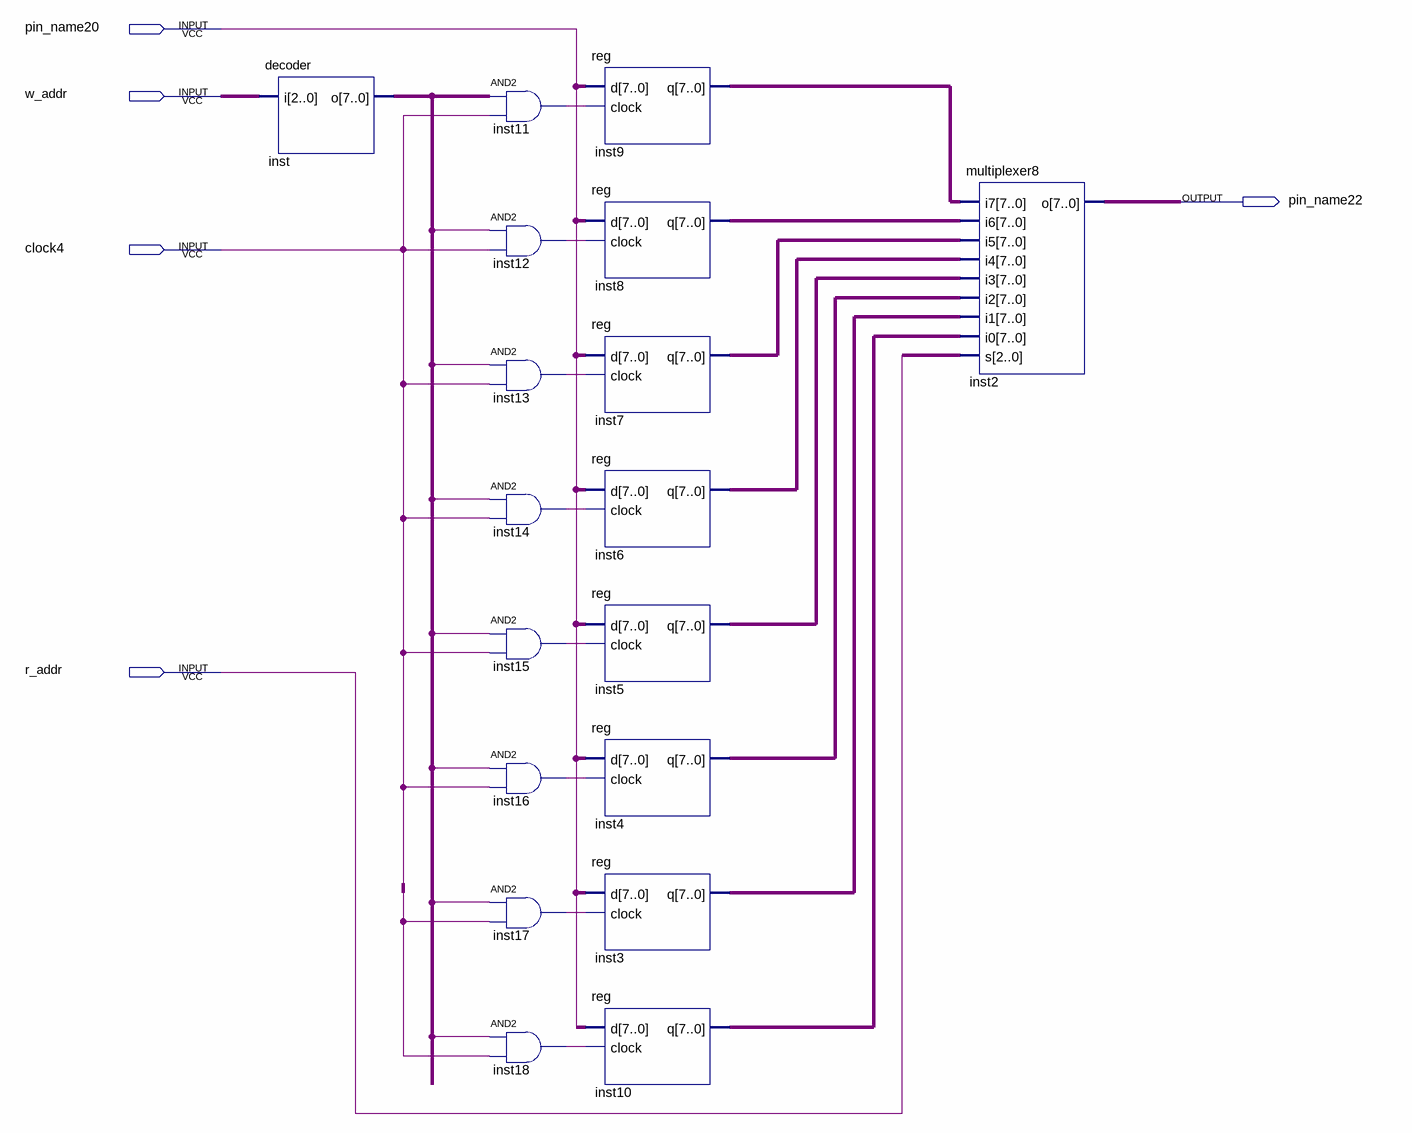
[diagram p0: schematic sheet]
// Quartus schematic registerfile.bdf as structural Verilog: 18 symbols, 5 pins
module registerfile (
  input  pin_name20,
  input  w_addr,
  input  clock4,
  input  r_addr,
  output pin_name22
);

  wire inst11_out, inst12_out, inst13_out, inst14_out, inst15_out, inst16_out, inst17_out, inst18_out,
       undriven, undriven_2, undriven_3, undriven_4, undriven_5, undriven_6, undriven_7, undriven_8;
  wire [2:0] undriven_9, undriven_10;
  wire [7:0] inst2_o, inst3_q, inst4_q, inst5_q, inst6_q, inst7_q, inst8_q, inst9_q, inst10_q, inst_o,
       undriven_11, undriven_12, undriven_13, undriven_14, undriven_15, undriven_16, undriven_17, undriven_18;

  decoder inst (.i(undriven_9), .o(inst_o));
  assign inst11_out = inst_o & {8{clock4}};  // AND2 inst11, 8 bits wide
  and inst12 (inst12_out, undriven, clock4);
  and inst13 (inst13_out, undriven_2, clock4);
  and inst14 (inst14_out, undriven_3, clock4);
  and inst15 (inst15_out, undriven_4, clock4);
  and inst16 (inst16_out, undriven_5, clock4);
  and inst17 (inst17_out, undriven_6, undriven_8);
  and inst18 (inst18_out, undriven_7, undriven_8);
  \reg  inst9 (.d(undriven_18), .clock(inst11_out), .q(inst9_q));
  \reg  inst8 (.d(undriven_17), .clock(inst12_out), .q(inst8_q));
  \reg  inst7 (.d(undriven_16), .clock(inst13_out), .q(inst7_q));
  \reg  inst6 (.d(undriven_15), .clock(inst14_out), .q(inst6_q));
  \reg  inst5 (.d(undriven_14), .clock(inst15_out), .q(inst5_q));
  \reg  inst4 (.d(undriven_13), .clock(inst16_out), .q(inst4_q));
  \reg  inst3 (.d(undriven_12), .clock(inst17_out), .q(inst3_q));
  \reg  inst10 (.d(undriven_11), .clock(inst18_out), .q(inst10_q));
  multiplexer8 inst2 (
    .i7(inst9_q), .i6(inst8_q), .i5(inst7_q), .i4(inst6_q), .i3(inst5_q), .i2(inst4_q), .i1(inst3_q),
    .i0(inst10_q), .s(undriven_10), .o(inst2_o));
endmodule
